# EAGLE schematic led_dimmer_8ch (EAGLE 9.6.2)
8-Channel LED Dimmer - ESP32 PWM Controller
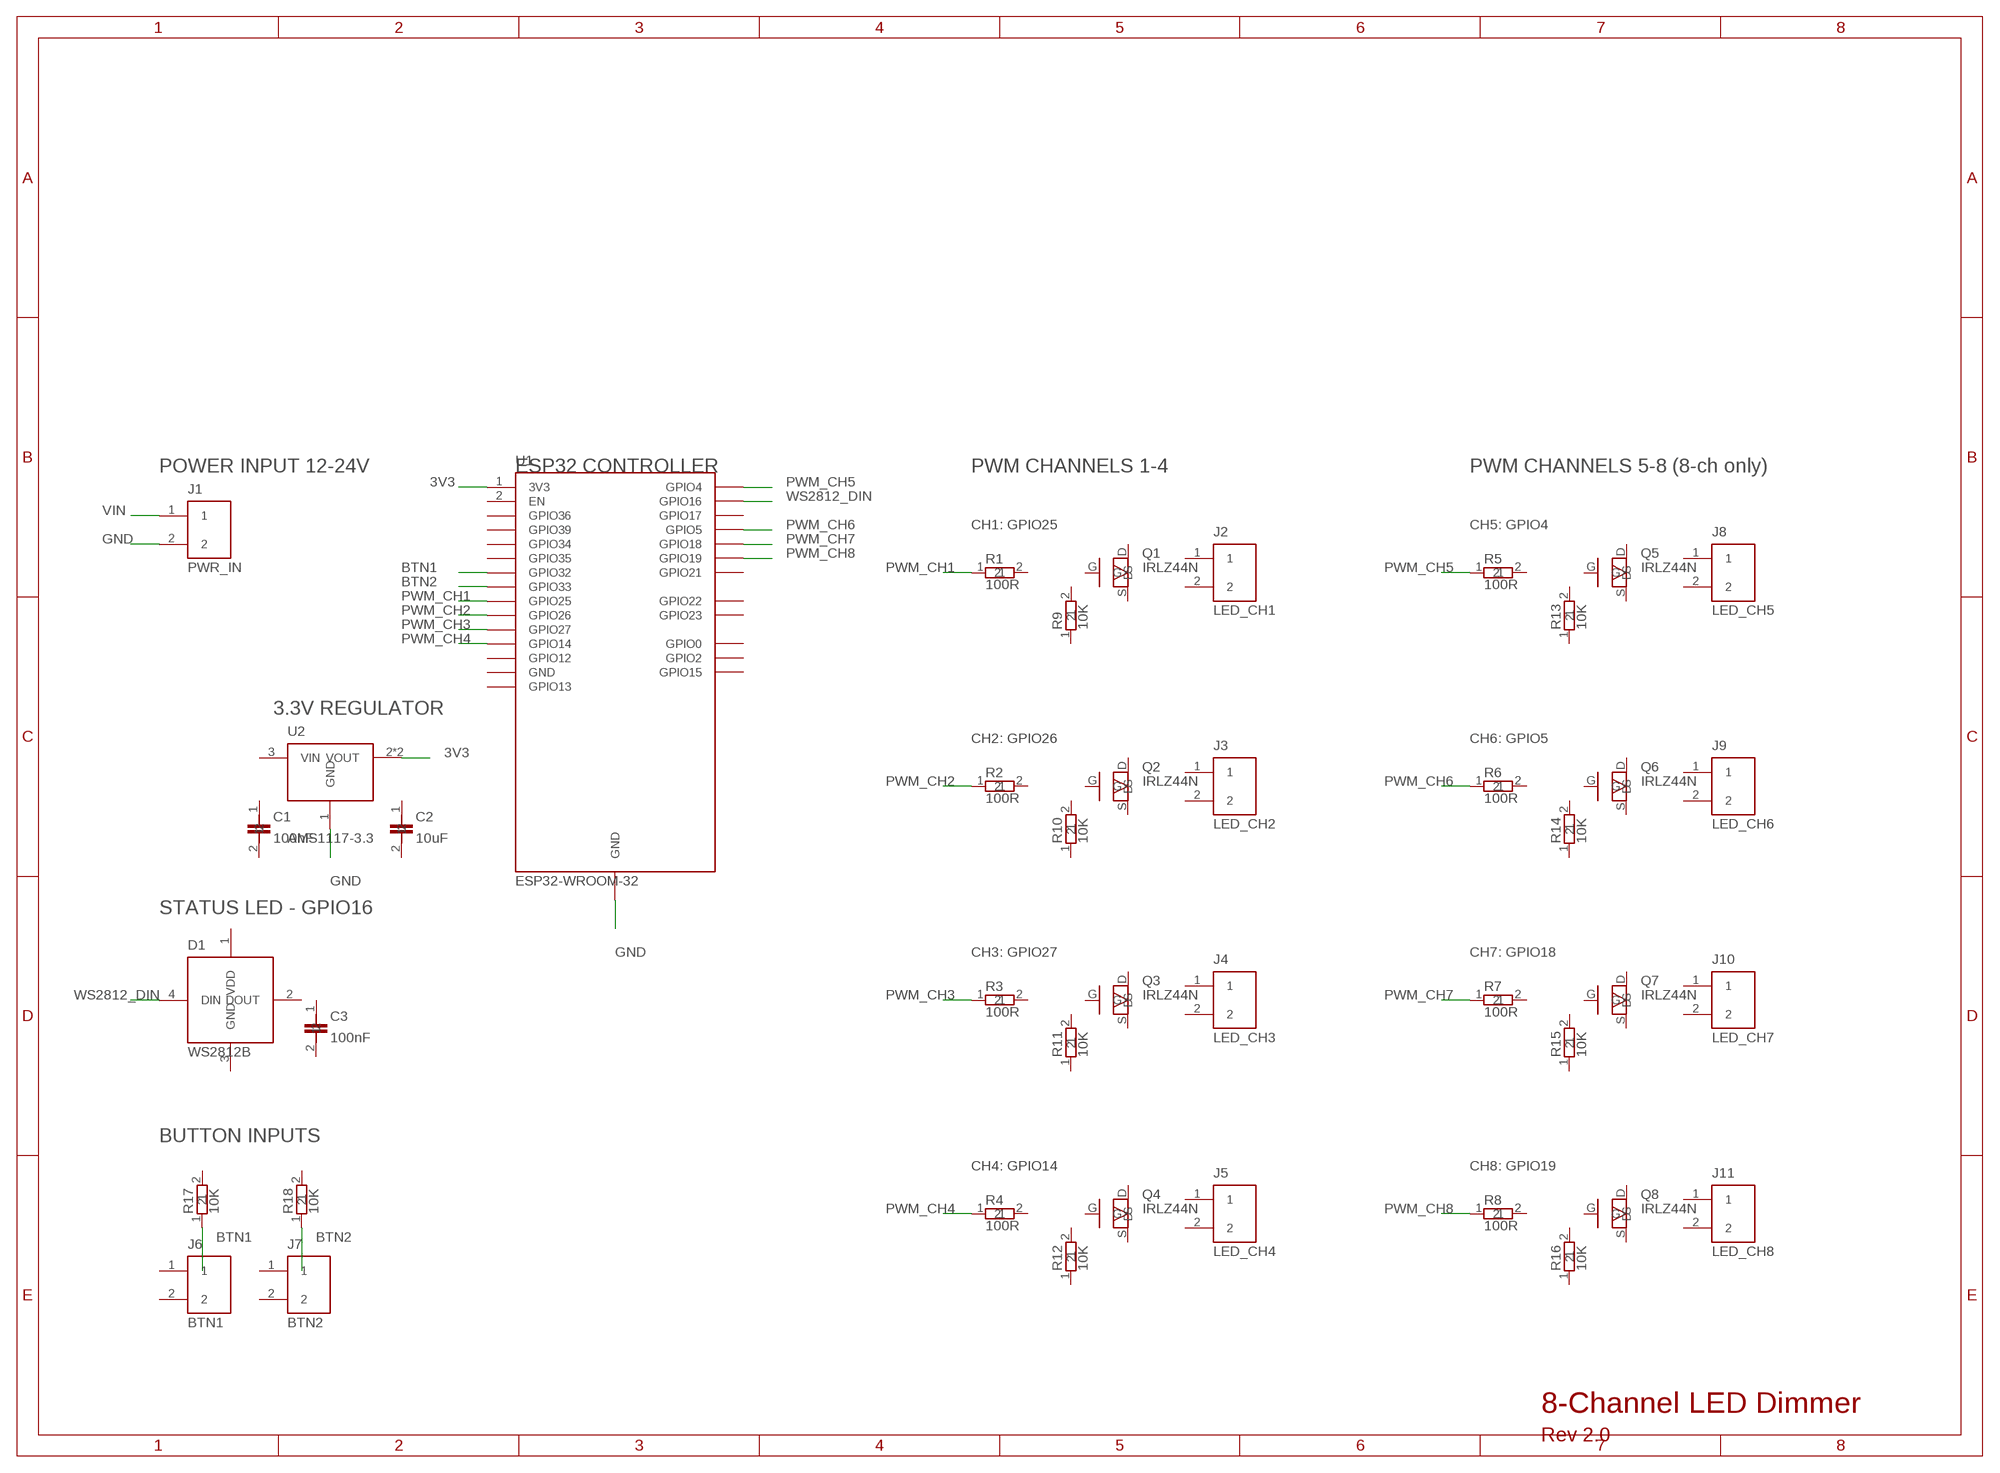
[diagram p0: schematic, sheet 1]

## Parts
C1  100nF  C0805  [0805]
C2  10uF  C0805  [0805]
C3  100nF  C0805  [0805]
D1  WS2812B  [5050-LED]
J1  PWR_IN  SCREW-2  [SCREWTERMINAL-2]
J2  LED_CH1  SCREW-2  [SCREWTERMINAL-2]
J3  LED_CH2  SCREW-2  [SCREWTERMINAL-2]
J4  LED_CH3  SCREW-2  [SCREWTERMINAL-2]
J5  LED_CH4  SCREW-2  [SCREWTERMINAL-2]
J6  BTN1  SCREW-2  [SCREWTERMINAL-2]
J7  BTN2  SCREW-2  [SCREWTERMINAL-2]
J8  LED_CH5  SCREW-2  [SCREWTERMINAL-2]
J9  LED_CH6  SCREW-2  [SCREWTERMINAL-2]
J10  LED_CH7  SCREW-2  [SCREWTERMINAL-2]
J11  LED_CH8  SCREW-2  [SCREWTERMINAL-2]
Q1  IRLZ44N  [TO220]
Q2  IRLZ44N  [TO220]
Q3  IRLZ44N  [TO220]
Q4  IRLZ44N  [TO220]
Q5  IRLZ44N  [TO220]
Q6  IRLZ44N  [TO220]
Q7  IRLZ44N  [TO220]
Q8  IRLZ44N  [TO220]
R1  100R  R0805  [0805]
R2  100R  R0805  [0805]
R3  100R  R0805  [0805]
R4  100R  R0805  [0805]
R5  100R  R0805  [0805]
R6  100R  R0805  [0805]
R7  100R  R0805  [0805]
R8  100R  R0805  [0805]
R9  10K  R0805  [0805]
R10  10K  R0805  [0805]
R11  10K  R0805  [0805]
R12  10K  R0805  [0805]
R13  10K  R0805  [0805]
R14  10K  R0805  [0805]
R15  10K  R0805  [0805]
R16  10K  R0805  [0805]
R17  10K  R0805  [0805]
R18  10K  R0805  [0805]
U1  ESP32-WROOM-32  [ESP32-WROOM-32]
U2  AMS1117-3.3  [SOT223]

## Nets
3V3: U1.1(3V3) U2.2(VOUT) U2.4(VOUT)
BTN1: J6.1 R17.1 U1.GPIO32
BTN2: J7.1 R18.1 U1.GPIO33
GND: J1.2 U1.GND U2.1(GND)
PWM_CH1: R1.1 U1.GPIO25
PWM_CH2: R2.1 U1.GPIO26
PWM_CH3: R3.1 U1.GPIO27
PWM_CH4: R4.1 U1.GPIO14
PWM_CH5: R5.1 U1.GPIO4
PWM_CH6: R6.1 U1.GPIO5
PWM_CH7: R7.1 U1.GPIO18
PWM_CH8: R8.1 U1.GPIO19
VIN: J1.1
WS2812_DIN: D1.4(DIN) U1.GPIO16
Unconnected: C1.1 C1.2 C2.1 C2.2 C3.1 C3.2 D1.2(DOUT) J2.1 J2.2 J3.1 J3.2 J4.1 J4.2 J5.1 J5.2 J6.2 J7.2 J8.1 J8.2 J9.1 J9.2 J10.1 J10.2 J11.1 J11.2 Q1.D Q1.G Q1.S Q2.D Q2.G Q2.S Q3.D Q3.G Q3.S Q4.D Q4.G Q4.S Q5.D Q5.G Q5.S Q6.D Q6.G Q6.S Q7.D Q7.G Q7.S Q8.D Q8.G Q8.S R1.2 R2.2 R3.2 R4.2 R5.2 R6.2 R7.2 R8.2 R9.1 R9.2 R10.1 R10.2 R11.1 R11.2 R12.1 R12.2 R13.1 R13.2 R14.1 R14.2 R15.1 R15.2 R16.1 R16.2 R17.2 R18.2 U1.2(EN)

## Notes on the sheet
- POWER INPUT 12-24V | ESP32 CONTROLLER | PWM CHANNELS 1-4 | PWM CHANNELS 5-8 (8-ch only)
- CH1: GPIO25 | CH5: GPIO4
- 3.3V REGULATOR
- CH2: GPIO26 | CH6: GPIO5
- STATUS LED - GPIO16
- CH3: GPIO27 | CH7: GPIO18
- BUTTON INPUTS
- CH4: GPIO14 | CH8: GPIO19
- 8-Channel LED Dimmer
- Rev 2.0

## Power pins joined to a net without a drawn wire
GND: D1.3(GND)
VDD: D1.1(VDD)
VIN: U2.3(VIN)

## Library data of the parts
C1-C3 = led_dimmer:C: Capacitor
D1 = led_dimmer:WS2812B: Addressable RGB LED
J1-J11 = led_dimmer:SCREW-2: 2-Position Screw Terminal
Q1-Q8 = led_dimmer:IRLZ44N: Logic Level N-Channel MOSFET
R1-R18 = led_dimmer:R: Resistor
U1 = led_dimmer:ESP32-WROOM-32
U2 = led_dimmer:AMS1117-3.3: 3.3V LDO Regulator